# EAGLE design at32uc3_proto_v7_eagle7x (EAGLE 7.7.0)
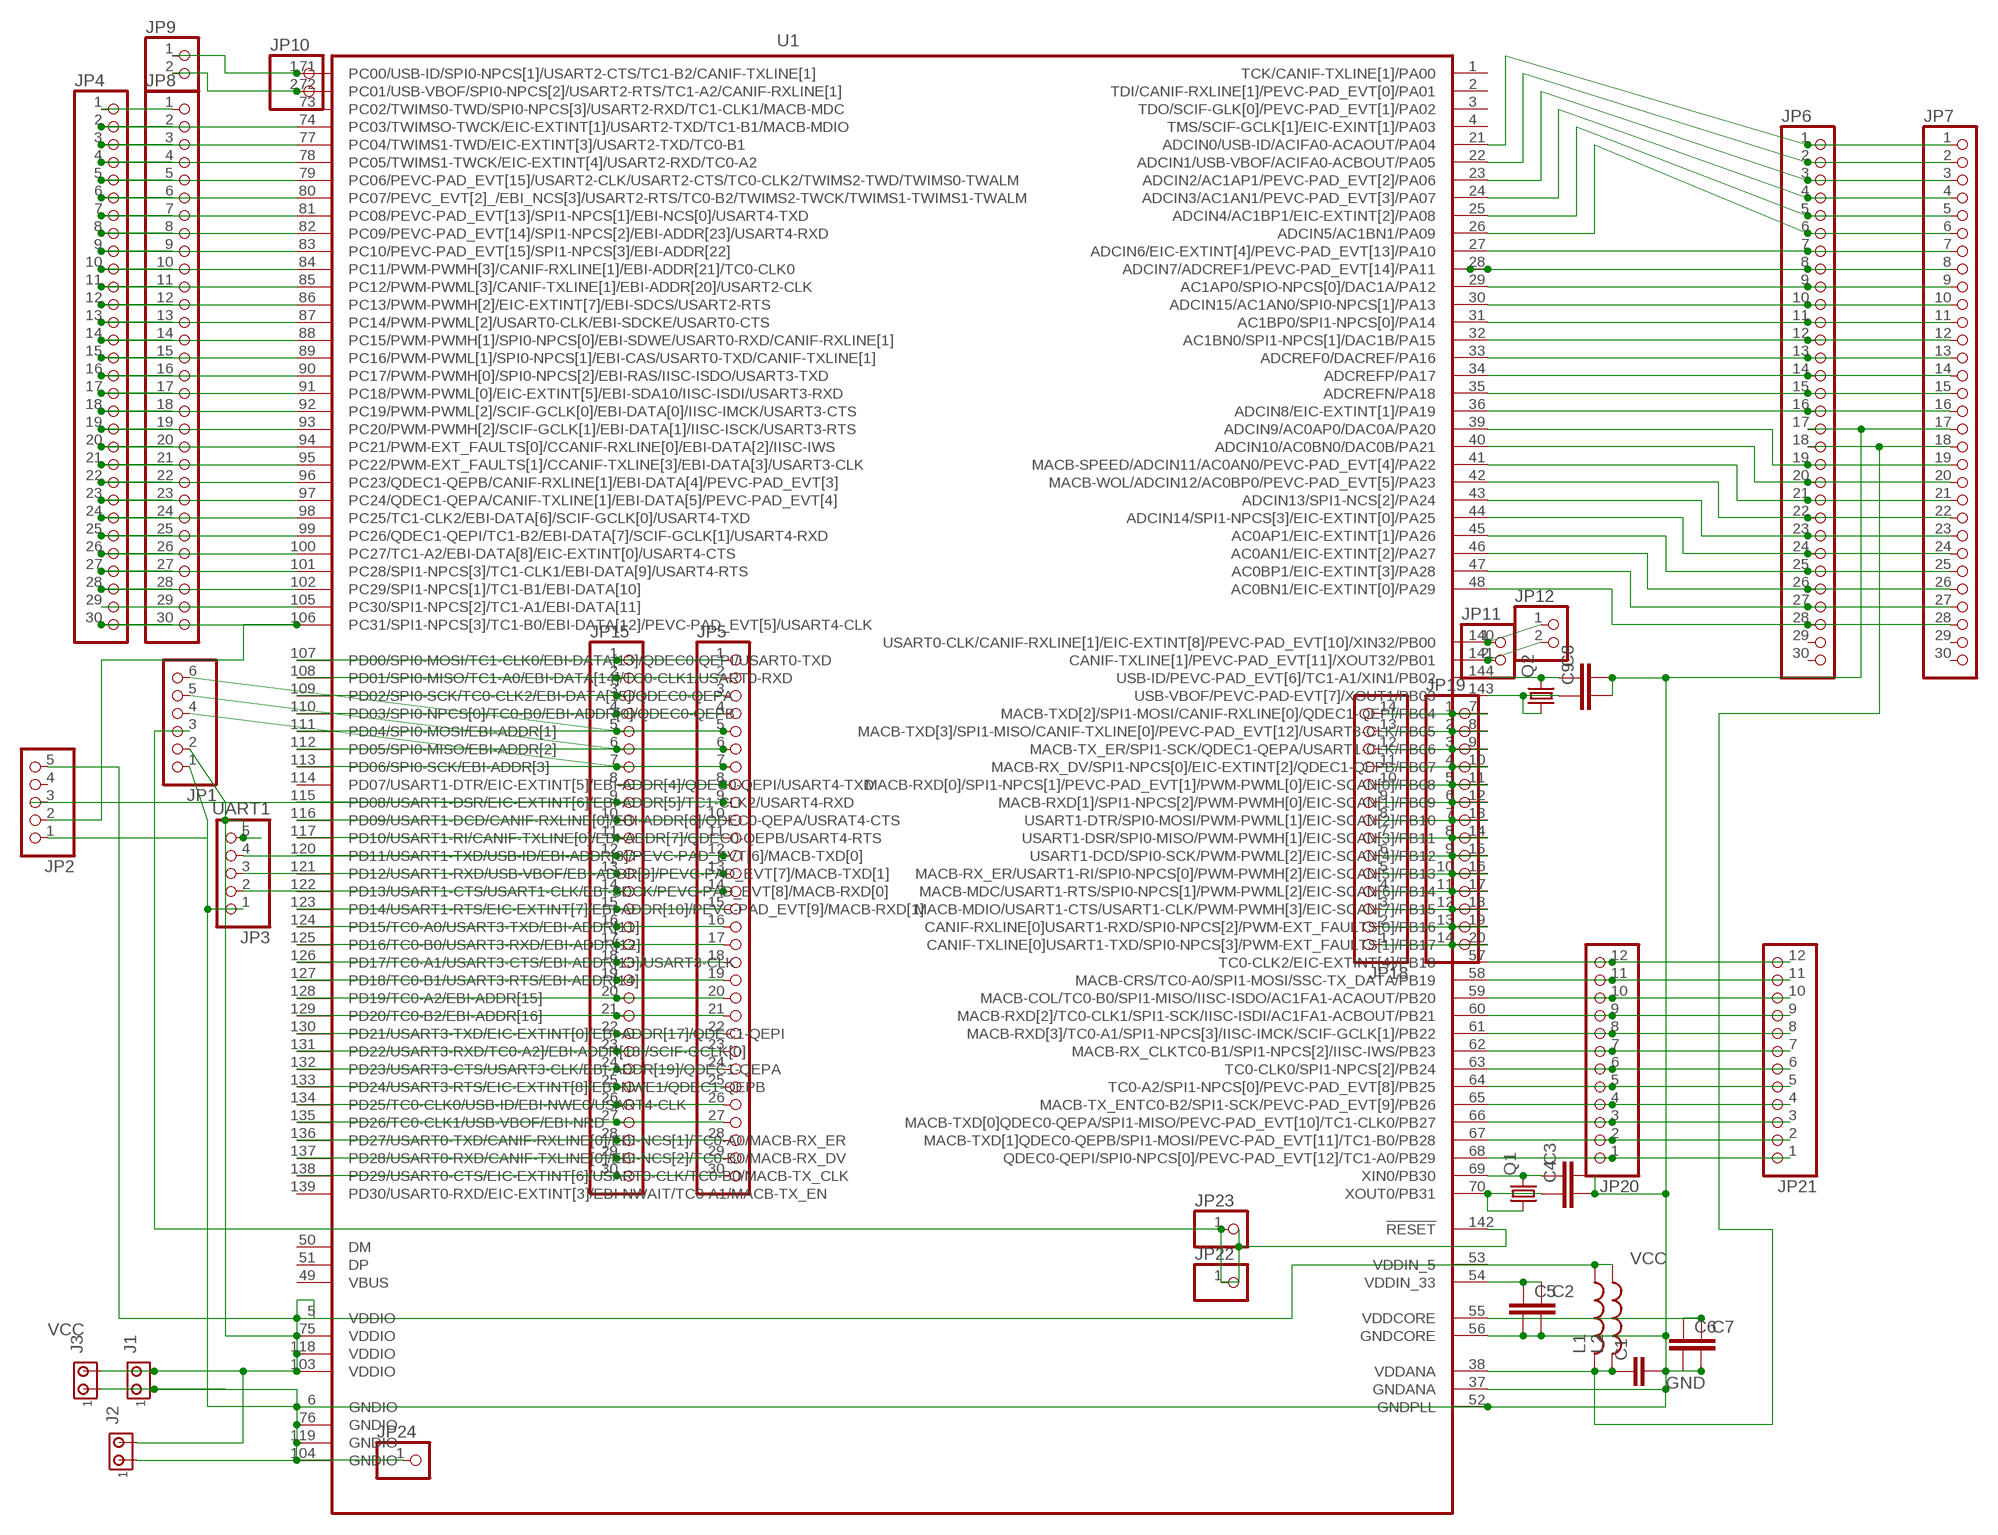
[diagram p0: schematic, sheet 1]

## Parts
C1  C-EU025-050X050  [C025-050X050]
C2  C-EUC1206K  [C1206K]
C3  C-EUC1206K  [C1206K]
C4  C-EUC1206K  [C1206K]
C5  C-EUC1206K  [C1206K]
C6  C-EUC1206K  [C1206K]
C7  C-EUC1206K  [C1206K]
C8  C-EUC1206K  [C1206K]
C9  C-EUC1206K  [C1206K]
J1  MTA02-100  [10X02MTA]
J2  MTA02-100  [10X02MTA]
J3  MTA02-100  [10X02MTA]
JP1  PINHD-1X6  [1X06]
JP2  PINHD-1X5  [1X05]
JP3  UART1  PINHD-1X5  [1X05]
JP4  PINHD-1X30  [1X30]
JP5  PINHD-1X30  [1X30]
JP6  PINHD-1X30  [1X30]
JP7  PINHD-1X30  [1X30]
JP8  PINHD-1X30  [1X30]
JP9  PINHD-1X2  [1X02]
JP10  PINHD-1X2  [1X02]
JP11  PINHD-1X2  [1X02]
JP12  PINHD-1X2  [1X02]
JP15  PINHD-1X30  [1X30]
JP18  PINHD-1X14  [1X14]
JP19  PINHD-1X14  [1X14]
JP20  PINHD-1X12  [1X12]
JP21  PINHD-1X12  [1X12]
JP22  PINHD-1X1  [1X01]
JP23  PINHD-1X1  [1X01]
JP24  PINHD-1X1  [1X01]
L1  L-US0207/10  [0207/10]
L2  L-USL4532C  [L4532M]
Q1  CRYSTALHC49S  [HC49/S]
Q2  CRYSTALHC49S  [HC49/S]
U1  AT32UC3C0128/0256/0512  [LQFP144]

## Nets
GND: C1.2 C2.2 C3.2 C4.2 C5.2 C6.2 C7.2 C8.2 C9.2 J1.1 J2.1 J3.1 JP1.1 JP2.1 JP3.1 JP6.17 JP7.17 JP24.1 U1.6(GNDIO) U1.37(GNDANA) U1.52(GNDPLL) U1.56(GNDCORE) U1.76(GNDIO) U1.104(GNDIO) U1.119(GNDIO)
N$1: C2.1 C5.1 U1.54(VDDIN_33)
N$2: C4.1 Q1.1 U1.70(XOUT0/PB31)
N$3: JP5.8 JP15.8
N$4: C3.1 Q1.2 U1.69(XIN0/PB30)
N$5: C6.1 C7.1 U1.55(VDDCORE)
N$6: C8.1 Q2.2 U1.144(USB-ID/PEVC-PAD_EVT[6]/TC1-A1/XIN1/PB02)
N$7: C9.1 Q2.1 U1.143(USB-VBOF/PEVC-PAD-EVT[7]/XOUT1/PB03)
N$8: JP1.6 JP5.5 JP15.5 U1.111(PD04/SPI0-MOSI/EBI-ADDR[1])
N$9: JP1.5 JP5.6 JP15.6 U1.112(PD05/SPI0-MISO/EBI-ADDR[2])
N$10: JP1.4 JP5.7 JP15.7 U1.113(PD06/SPI0-SCK/EBI-ADDR[3])
N$11: JP1.3 JP22.1 JP23.1 U1.142(!RESET)
N$13: JP5.9 JP15.9 U1.115(PD08/USART1-DSR/EIC-EXTINT[6]/EBI-ADDR[5]/TC1-CLK2/USART4-RXD)
N$14: JP4.1 JP8.1
N$15: JP4.2 JP8.2 U1.74(PC03/TWIMSO-TWCK/EIC-EXTINT[1]/USART2-TXD/TC1-B1/MACB-MDIO)
N$16: JP3.4 JP5.12 JP15.12 U1.120(PD11/USART1-TXD/USB-ID/EBI-ADDR[8]/PEVC-PAD_EVT[6]/MACB-TXD[0])
N$17: JP3.3 JP5.13 JP15.13 U1.121(PD12/USART1-RXD/USB-VBOF/EBI-ADDR[9]/PEVC-PAD_EVT[7]/MACB-TXD[1])
N$18: JP3.2 JP5.14 JP15.14 U1.122(PD13/USART1-CTS/USART1-CLK/EBI-SDCK/PEVC-PAD_EVT[8]/MACB-RXD[0])
N$19: JP4.3 JP8.3 U1.77(PC04/TWIMS1-TWD/EIC-EXTINT[3]/USART2-TXD/TC0-B1)
N$20: JP4.4 JP8.4 U1.78(PC05/TWIMS1-TWCK/EIC-EXTINT[4]/USART2-RXD/TC0-A2)
N$21: JP4.5 JP8.5 U1.79(PC06/PEVC-PAD_EVT[15]/USART2-CLK/USART2-CTS/TC0-CLK2/TWIMS2-TWD/TWIMS0-TWALM)
N$22: JP4.6 JP8.6 U1.80(PC07/PEVC_EVT[2]_/EBI_NCS[3]/USART2-RTS/TC0-B2/TWIMS2-TWCK/TWIMS1-TWIMS1-TWALM)
N$23: JP4.7 JP8.7 U1.81(PC08/PEVC-PAD_EVT[13]/SPI1-NPCS[1]/EBI-NCS[0]/USART4-TXD)
N$24: JP4.8 JP8.8 U1.82(PC09/PEVC-PAD_EVT[14]/SPI1-NPCS[2]/EBI-ADDR[23]/USART4-RXD)
N$25: JP4.9 JP8.9 U1.83(PC10/PEVC-PAD_EVT[15]/SPI1-NPCS[3]/EBI-ADDR[22])
N$26: JP4.10 JP8.10 U1.84(PC11/PWM-PWMH[3]/CANIF-RXLINE[1]/EBI-ADDR[21]/TC0-CLK0)
N$27: JP4.11 JP8.11 U1.85(PC12/PWM-PWML[3]/CANIF-TXLINE[1]/EBI-ADDR[20]/USART2-CLK)
N$28: JP4.12 JP8.12 U1.86(PC13/PWM-PWMH[2]/EIC-EXTINT[7]/EBI-SDCS/USART2-RTS)
N$29: JP4.13 JP8.13 U1.87(PC14/PWM-PWML[2]/USART0-CLK/EBI-SDCKE/USART0-CTS)
N$30: JP4.14 JP8.14 U1.88(PC15/PWM-PWMH[1]/SPI0-NPCS[0]/EBI-SDWE/USART0-RXD/CANIF-RXLINE[1])
N$31: JP4.15 JP8.15 U1.89(PC16/PWM-PWML[1]/SPI0-NPCS[1]/EBI-CAS/USART0-TXD/CANIF-TXLINE[1])
N$32: JP11.1 JP12.1 U1.140(USART0-CLK/CANIF-RXLINE[1]/EIC-EXTINT[8]/PEVC-PAD_EVT[10]/XIN32/PB00)
N$33: JP4.16 JP8.16 U1.90(PC17/PWM-PWMH[0]/SPI0-NPCS[2]/EBI-RAS/IISC-ISDO/USART3-TXD)
N$34: JP4.17 JP8.17 U1.91(PC18/PWM-PWML[0]/EIC-EXTINT[5]/EBI-SDA10/IISC-ISDI/USART3-RXD)
N$35: JP4.18 JP8.18 U1.92(PC19/PWM-PWML[2]/SCIF-GCLK[0]/EBI-DATA[0]/IISC-IMCK/USART3-CTS)
N$36: JP4.19 JP8.19 U1.93(PC20/PWM-PWMH[2]/SCIF-GCLK[1]/EBI-DATA[1]/IISC-ISCK/USART3-RTS)
N$37: JP4.20 JP8.20 U1.94(PC21/PWM-EXT_FAULTS[0]/CCANIF-RXLINE[0]/EBI-DATA[2]/IISC-IWS)
N$38: JP4.21 JP8.21 U1.95(PC22/PWM-EXT_FAULTS[1]/CCANIF-TXLINE[3]/EBI-DATA[3]/USART3-CLK)
N$39: JP4.22 JP8.22 U1.96(PC23/QDEC1-QEPB/CANIF-RXLINE[1]/EBI-DATA[4]/PEVC-PAD_EVT[3])
N$40: JP4.23 JP8.23 U1.97(PC24/QDEC1-QEPA/CANIF-TXLINE[1]/EBI-DATA[5]/PEVC-PAD_EVT[4])
N$41: JP4.24 JP8.24 U1.98(PC25/TC1-CLK2/EBI-DATA[6]/SCIF-GCLK[0]/USART4-TXD)
N$42: JP4.25 JP8.25 U1.99(PC26/QDEC1-QEPI/TC1-B2/EBI-DATA[7]/SCIF-GCLK[1]/USART4-RXD)
N$43: JP4.26 JP8.26 U1.100(PC27/TC1-A2/EBI-DATA[8]/EIC-EXTINT[0]/USART4-CTS)
N$44: JP4.27 JP8.27 U1.101(PC28/SPI1-NPCS[3]/TC1-CLK1/EBI-DATA[9]/USART4-RTS)
N$45: JP4.28 JP8.28 U1.102(PC29/SPI1-NPCS[1]/TC1-B1/EBI-DATA[10])
N$46: JP4.29 JP8.29 U1.105(PC30/SPI1-NPCS[2]/TC1-A1/EBI-DATA[11])
N$47: JP2.2 JP4.30 JP8.30 U1.106(PC31/SPI1-NPCS[3]/TC1-B0/EBI-DATA[12]/PEVC-PAD_EVT[5]/USART4-CLK)
N$48: JP5.1 JP15.1 U1.107(PD00/SPI0-MOSI/TC1-CLK0/EBI-DATA[13]/QDEC0-QEPI/USART0-TXD)
N$49: JP5.2 JP15.2 U1.108(PD01/SPI0-MISO/TC1-A0/EBI-DATA[14]/TC0-CLK1/USART0-RXD)
N$50: JP5.3 JP15.3 U1.109(PD02/SPI0-SCK/TC0-CLK2/EBI-DATA[15]/QDEC0-QEPA)
N$51: JP5.4 JP15.4 U1.110(PD03/SPI0-NPCS[0]/TC0-B0/EBI-ADDR[0]/QDEC0-QEPB)
N$52: JP5.10 JP15.10 U1.116(PD09/USART1-DCD/CANIF-RXLINE[0]/EBI-ADDR[6]/QDEC0-QEPA/USRAT4-CTS)
N$53: JP5.11 JP15.11 U1.117(PD10/USART1-RI/CANIF-TXLINE[0]/EBI-ADDR[7]/QDEC0-QEPB/USART4-RTS)
N$54: JP5.15 JP15.15 U1.123(PD14/USART1-RTS/EIC-EXTINT[7]/EBI-ADDR[10]/PEVC-PAD_EVT[9]/MACB-RXD[1])
N$55: JP5.16 JP15.16 U1.124(PD15/TC0-A0/USART3-TXD/EBI-ADDR[11])
N$56: JP5.17 JP15.17 U1.125(PD16/TC0-B0/USART3-RXD/EBI-ADDR[12])
N$57: JP5.18 JP15.18 U1.126(PD17/TC0-A1/USART3-CTS/EBI-ADDR[13]/USART3-CLK)
N$58: JP5.19 JP15.19 U1.127(PD18/TC0-B1/USART3-RTS/EBI-ADDR[14])
N$59: JP5.20 JP15.20 U1.128(PD19/TC0-A2/EBI-ADDR[15])
N$60: JP5.21 JP15.21 U1.129(PD20/TC0-B2/EBI-ADDR[16])
N$61: JP5.22 JP15.22 U1.130(PD21/USART3-TXD/EIC-EXTINT[0]/EBI-ADDR[17]/QDEC1-QEPI)
N$62: JP5.23 JP15.23 U1.131(PD22/USART3-RXD/TC0-A2]/EBI-ADDR[18]/SCIF-GCLK[0])
N$63: JP5.24 JP15.24 U1.132(PD23/USART3-CTS/USART3-CLK/EBI-ADDR[19]/QDEC1-QEPA)
N$64: JP5.25 JP15.25 U1.133(PD24/USART3-RTS/EIC-EXTINT[8]/EBI-NWE1/QDEC1-QEPB)
N$65: JP5.26 JP15.26 U1.134(PD25/TC0-CLK0/USB-ID/EBI-NWE0/USART4-CLK)
N$66: JP5.27 JP15.27 U1.135(PD26/TC0-CLK1/USB-VBOF/EBI-NRD)
N$67: JP5.28 JP15.28 U1.136(PD27/USART0-TXD/CANIF-RXLINE[0]/EBI-NCS[1]/TC0-A0/MACB-RX_ER)
N$68: JP5.29 JP15.29 U1.137(PD28/USART0-RXD/CANIF-TXLINE[0]/EBI-NCS[2]/TC0-B0/MACB-RX_DV)
N$69: JP5.30 JP15.30 U1.138(PD29/USART0-CTS/EIC-EXTINT[6]/USART0-CLK/TC0-B0/MACB-TX_CLK)
N$70: JP9.1 JP10.1 U1.71(PC00/USB-ID/SPI0-NPCS[1]/USART2-CTS/TC1-B2/CANIF-TXLINE[1])
N$71: JP6.1 JP7.1 U1.21(ADCIN0/USB-ID/ACIFA0-ACAOUT/PA04)
N$72: JP6.2 JP7.2 U1.22(ADCIN1/USB-VBOF/ACIFA0-ACBOUT/PA05)
N$73: JP6.3 JP7.3 U1.23(ADCIN2/AC1AP1/PEVC-PAD_EVT[2]/PA06)
N$74: JP6.4 JP7.4 U1.24(ADCIN3/AC1AN1/PEVC-PAD_EVT[3]/PA07)
N$75: JP6.5 JP7.5 U1.25(ADCIN4/AC1BP1/EIC-EXTINT[2]/PA08)
N$76: JP6.6 JP7.6 U1.26(ADCIN5/AC1BN1/PA09)
N$77: JP6.9 JP7.9 U1.29(AC1AP0/SPIO-NPCS[0]/DAC1A/PA12)
N$78: JP6.8 JP7.8 U1.28(ADCIN7/ADCREF1/PEVC-PAD_EVT[14]/PA11)
N$79: JP6.7 JP7.7 U1.27(ADCIN6/EIC-EXTINT[4]/PEVC-PAD_EVT[13]/PA10)
N$80: JP6.10 JP7.10 U1.30(ADCIN15/AC1AN0/SPI0-NPCS[1]/PA13)
N$81: JP6.11 JP7.11 U1.31(AC1BP0/SPI1-NPCS[0]/PA14)
N$82: JP6.12 JP7.12 U1.32(AC1BN0/SPI1-NPCS[1]/DAC1B/PA15)
N$83: JP6.13 JP7.13 U1.33(ADCREF0/DACREF/PA16)
N$84: JP6.14 JP7.14 U1.34(ADCREFP/PA17)
N$85: JP6.15 JP7.15 U1.35(ADCREFN/PA18)
N$86: JP6.16 JP7.16 U1.36(ADCIN8/EIC-EXTINT[1]/PA19)
N$87: JP6.19 JP7.19 U1.39(ADCIN9/AC0AP0/DAC0A/PA20)
N$88: JP6.20 JP7.20 U1.40(ADCIN10/AC0BN0/DAC0B/PA21)
N$89: JP6.21 JP7.21 U1.41(MACB-SPEED/ADCIN11/AC0AN0/PEVC-PAD_EVT[4]/PA22)
N$90: JP6.22 JP7.22 U1.42(MACB-WOL/ADCIN12/AC0BP0/PEVC-PAD_EVT[5]/PA23)
N$91: JP6.23 JP7.23 U1.43(ADCIN13/SPI1-NCS[2]/PA24)
N$92: JP6.24 JP7.24 U1.44(ADCIN14/SPI1-NPCS[3]/EIC-EXTINT[0]/PA25)
N$93: JP6.25 JP7.25 U1.45(AC0AP1/EIC-EXTINT[1]/PA26)
N$94: JP6.26 JP7.26 U1.46(AC0AN1/EIC-EXTINT[2]/PA27)
N$95: JP6.27 JP7.27 U1.47(AC0BP1/EIC-EXTINT[3]/PA28)
N$96: JP6.28 JP7.28 U1.48(AC0BN1/EIC-EXTINT[0]/PA29)
N$100: JP9.2 JP10.2 U1.72(PC01/USB-VBOF/SPI0-NPCS[2]/USART2-RTS/TC1-A2/CANIF-RXLINE[1])
N$101: JP11.2 JP12.2 U1.141(CANIF-TXLINE[1]/PEVC-PAD_EVT[11]/XOUT32/PB01)
N$106: JP18.1 JP19.14 U1.20(CANIF-TXLINE[0]USART1-TXD/SPI0-NPCS[3]/PWM-EXT_FAULTS[1]/PB17)
N$107: JP18.2 JP19.13 U1.19(CANIF-RXLINE[0]USART1-RXD/SPI0-NPCS[2]/PWM-EXT_FAULTS[0]/PB16)
N$108: JP18.3 JP19.12 U1.18(MACB-MDIO/USART1-CTS/USART1-CLK/PWM-PWMH[3]/EIC-SCAN[7]/PB15)
N$109: JP18.4 JP19.11 U1.17(MACB-MDC/USART1-RTS/SPI0-NPCS[1]/PWM-PWML[2]/EIC-SCAN[6]/PB14)
N$110: JP18.5 JP19.10 U1.16(MACB-RX_ER/USART1-RI/SPI0-NPCS[0]/PWM-PWMH[2]/EIC-SCAN[5]/PB13)
N$111: JP18.6 JP19.9 U1.15(USART1-DCD/SPI0-SCK/PWM-PWML[2]/EIC-SCAN[4]/PB12)
N$112: JP18.7 JP19.8 U1.14(USART1-DSR/SPI0-MISO/PWM-PWMH[1]/EIC-SCAN[3]/PB11)
N$113: JP18.8 JP19.7 U1.13(USART1-DTR/SPI0-MOSI/PWM-PWML[1]/EIC-SCAN[2]/PB10)
N$114: JP18.9 JP19.6 U1.12(MACB-RXD[1]/SPI1-NPCS[2]/PWM-PWMH[0]/EIC-SCAN[1]/PB09)
N$115: JP18.10 JP19.5 U1.11(MACB-RXD[0]/SPI1-NPCS[1]/PEVC-PAD_EVT[1]/PWM-PWML[0]/EIC-SCAN[0]/PB08)
N$116: JP18.11 JP19.4 U1.10(MACB-RX_DV/SPI1-NPCS[0]/EIC-EXTINT[2]/QDEC1-QEPB/PB07)
N$117: JP18.12 JP19.3 U1.9(MACB-TX_ER/SPI1-SCK/QDEC1-QEPA/USART1-CLK/PB06)
N$118: JP18.13 JP19.2 U1.8(MACB-TXD[3]/SPI1-MISO/CANIF-TXLINE[0]/PEVC-PAD_EVT[12]/USART3-CLK/PB05)
N$119: JP18.14 JP19.1 U1.7(MACB-TXD[2]/SPI1-MOSI/CANIF-RXLINE[0]/QDEC1-QEPI/PB04)
N$120: JP20.1 JP21.1 U1.68(QDEC0-QEPI/SPI0-NPCS[0]/PEVC-PAD_EVT[12]/TC1-A0/PB29)
N$121: JP20.2 JP21.2 U1.67(MACB-TXD[1]QDEC0-QEPB/SPI1-MOSI/PEVC-PAD_EVT[11]/TC1-B0/PB28)
N$122: JP20.3 JP21.3 U1.66(MACB-TXD[0]QDEC0-QEPA/SPI1-MISO/PEVC-PAD_EVT[10]/TC1-CLK0/PB27)
N$123: JP20.4 JP21.4 U1.65(MACB-TX_ENTC0-B2/SPI1-SCK/PEVC-PAD_EVT[9]/PB26)
N$124: JP20.5 JP21.5 U1.64(TC0-A2/SPI1-NPCS[0]/PEVC-PAD_EVT[8]/PB25)
N$125: JP20.6 JP21.6 U1.63(TC0-CLK0/SPI1-NPCS[2]/PB24)
N$126: JP20.7 JP21.7 U1.62(MACB-RX_CLKTC0-B1/SPI1-NPCS[2]/IISC-IWS/PB23)
N$127: JP20.8 JP21.8 U1.61(MACB-RXD[3]/TC0-A1/SPI1-NPCS[3]/IISC-IMCK/SCIF-GCLK[1]/PB22)
N$128: JP20.9 JP21.9 U1.60(MACB-RXD[2]/TC0-CLK1/SPI1-SCK/IISC-ISDI/AC1FA1-ACBOUT/PB21)
N$129: JP20.10 JP21.10 U1.59(MACB-COL/TC0-B0/SPI1-MISO/IISC-ISDO/AC1FA1-ACAOUT/PB20)
N$130: JP20.11 JP21.11 U1.58(MACB-CRS/TC0-A0/SPI1-MOSI/SSC-TX_DATA/PB19)
N$131: JP20.12 JP21.12 U1.57(TC0-CLK2/EIC-EXTINT[4]/PB18)
N$133: C1.1 JP6.18 JP7.18 L1.2 L2.2 U1.38(VDDANA)
VCC: J1.2 J2.2 J3.2 JP1.2 JP2.5 JP3.5 L1.1 L2.1 U1.5(VDDIO) U1.53(VDDIN_5) U1.75(VDDIO) U1.103(VDDIO) U1.118(VDDIO)
Unconnected: JP2.3 JP2.4 JP6.29 JP6.30 JP7.29 JP7.30 U1.1(TCK/CANIF-TXLINE[1]/PA00) U1.2(TDI/CANIF-RXLINE[1]/PEVC-PAD_EVT[0]/PA01) U1.3(TDO/SCIF-GLK[0]/PEVC-PAD_EVT[1]/PA02) U1.4(TMS/SCIF-GCLK[1]/EIC-EXINT[1]/PA03) U1.49(VBUS) U1.50(DM) U1.51(DP) U1.73(PC02/TWIMS0-TWD/SPI0-NPCS[3]/USART2-RXD/TC1-CLK1/MACB-MDC) U1.114(PD07/USART1-DTR/EIC-EXTINT[5]/EBI-ADDR[4]/QDEC0-QEPI/USART4-TXD) U1.139(PD30/USART0-RXD/EIC-EXTINT[3]/EBI-NWAIT/TC0-A1/MACB-TX_EN)

## Library data of the parts
C1-C9 = rcl:C-EU: CAPACITOR, European symbol
J1-J3 = con-amp:MTA02-100: AMP connector
JP1 = pinhead:PINHD-1X6: PIN HEADER
JP2 JP3 = pinhead:PINHD-1X5: PIN HEADER
JP4-JP8 JP15 = pinhead:PINHD-1X30: PIN HEADER
JP9-JP12 = pinhead:PINHD-1X2: PIN HEADER
JP18 JP19 = pinhead:PINHD-1X14: PIN HEADER
JP20 JP21 = pinhead:PINHD-1X12: PIN HEADER
JP22-JP24 = pinhead:PINHD-1X1: PIN HEADER
L1 L2 = rcl:L-US: INDUCTOR, American symbol
Q1 Q2 = crystal:CRYSTAL: CRYSTAL
U1 = atmel-avr32-michel-rev1 - Copy:AT32UC3C0128/0256/0512: AT32UC3C0128/0256/0512

## Board
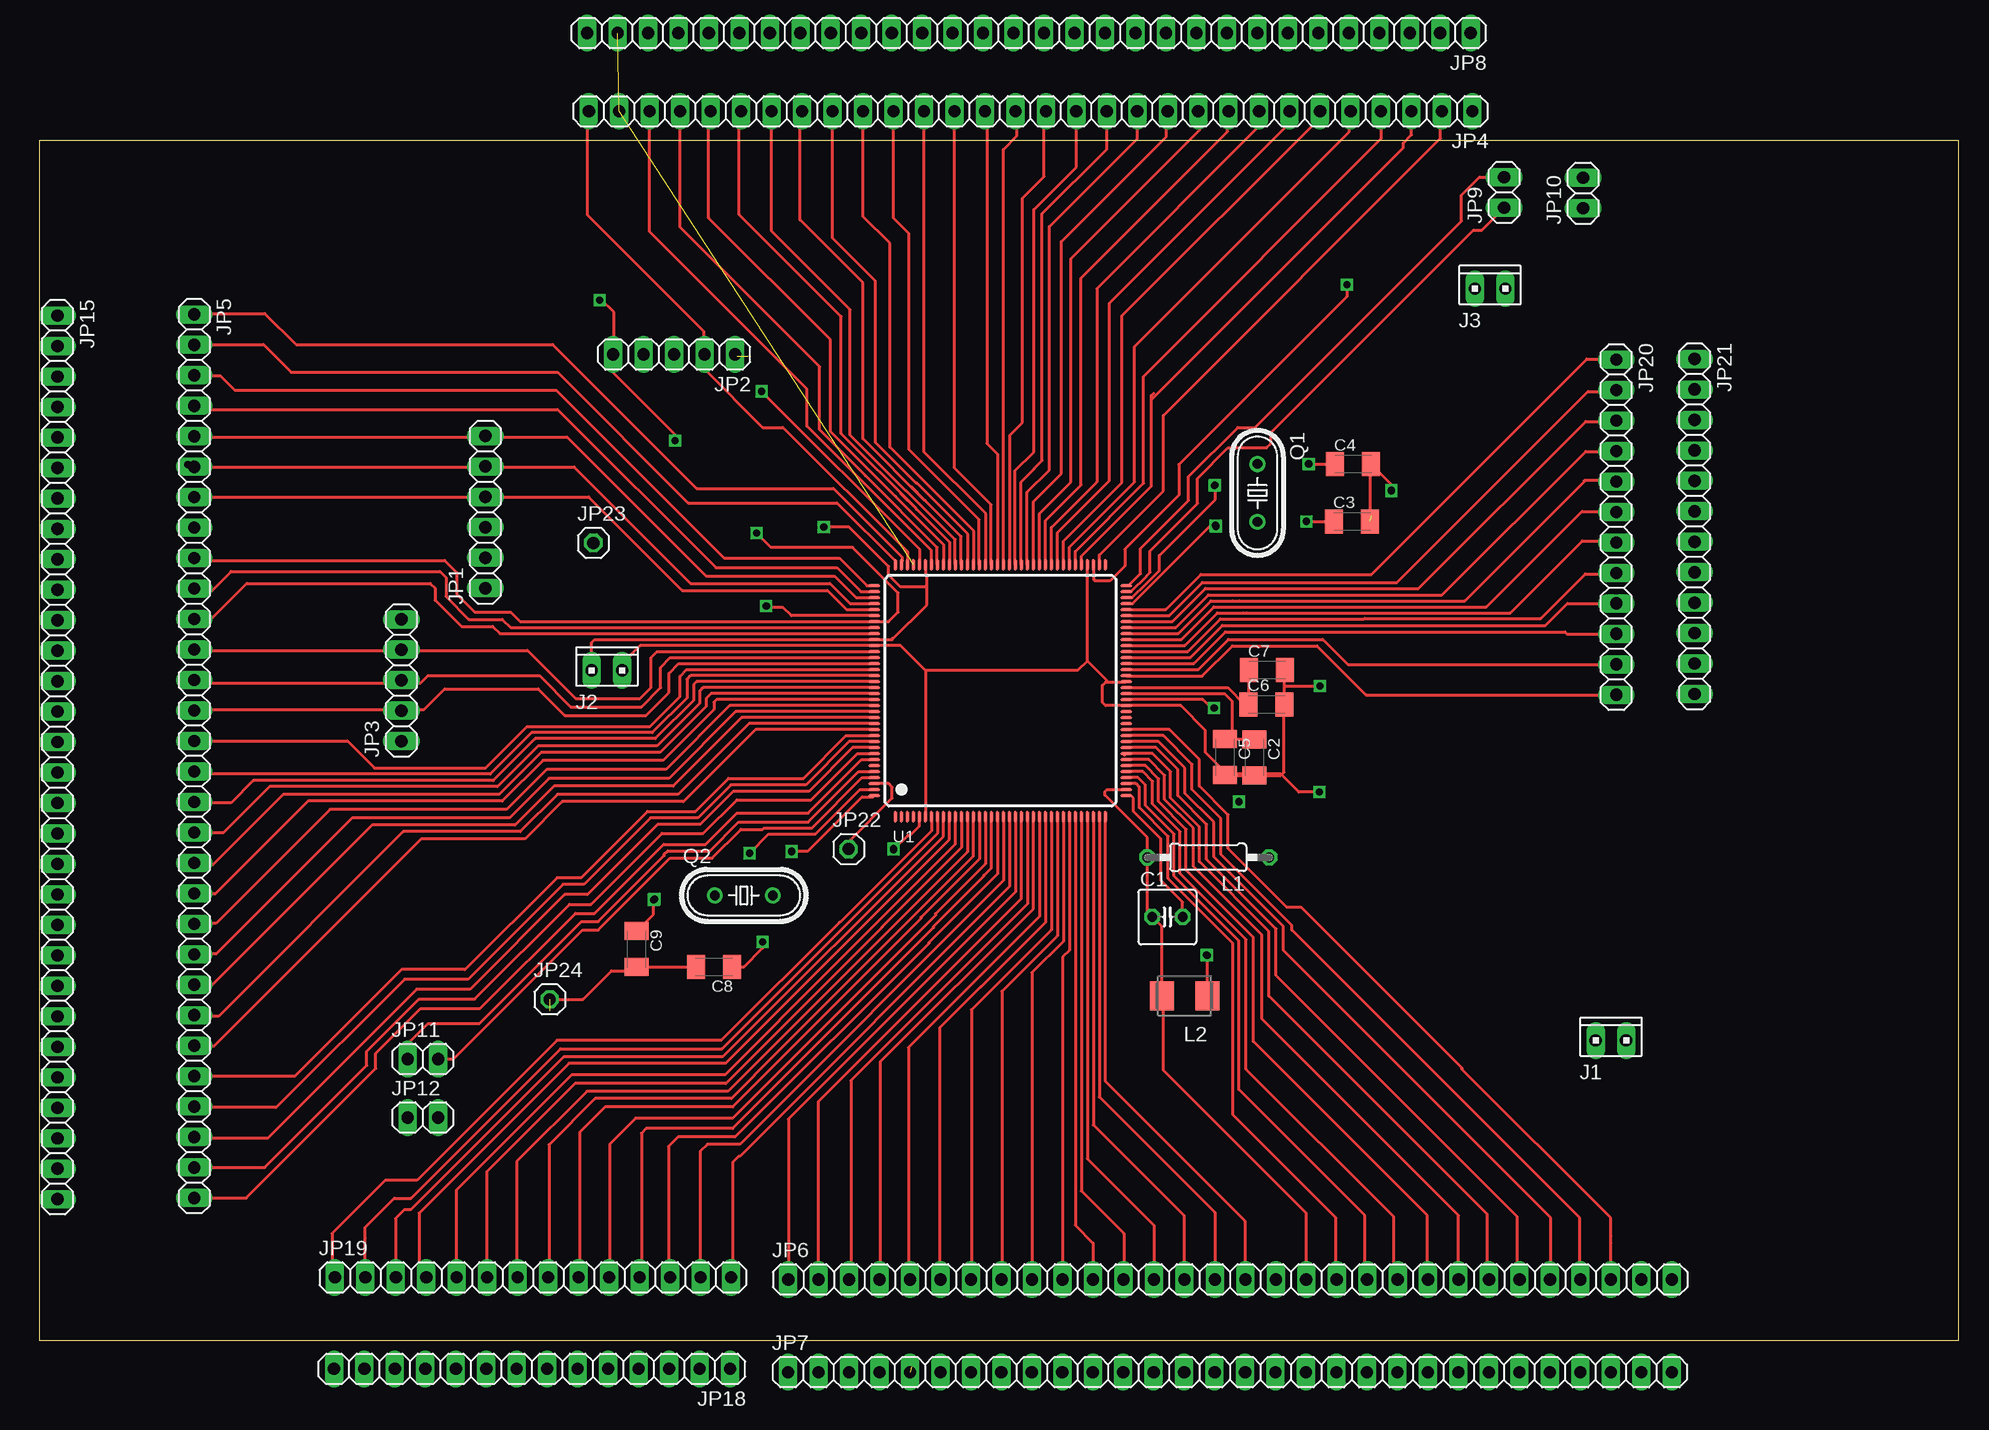
[diagram p1: board, top side]
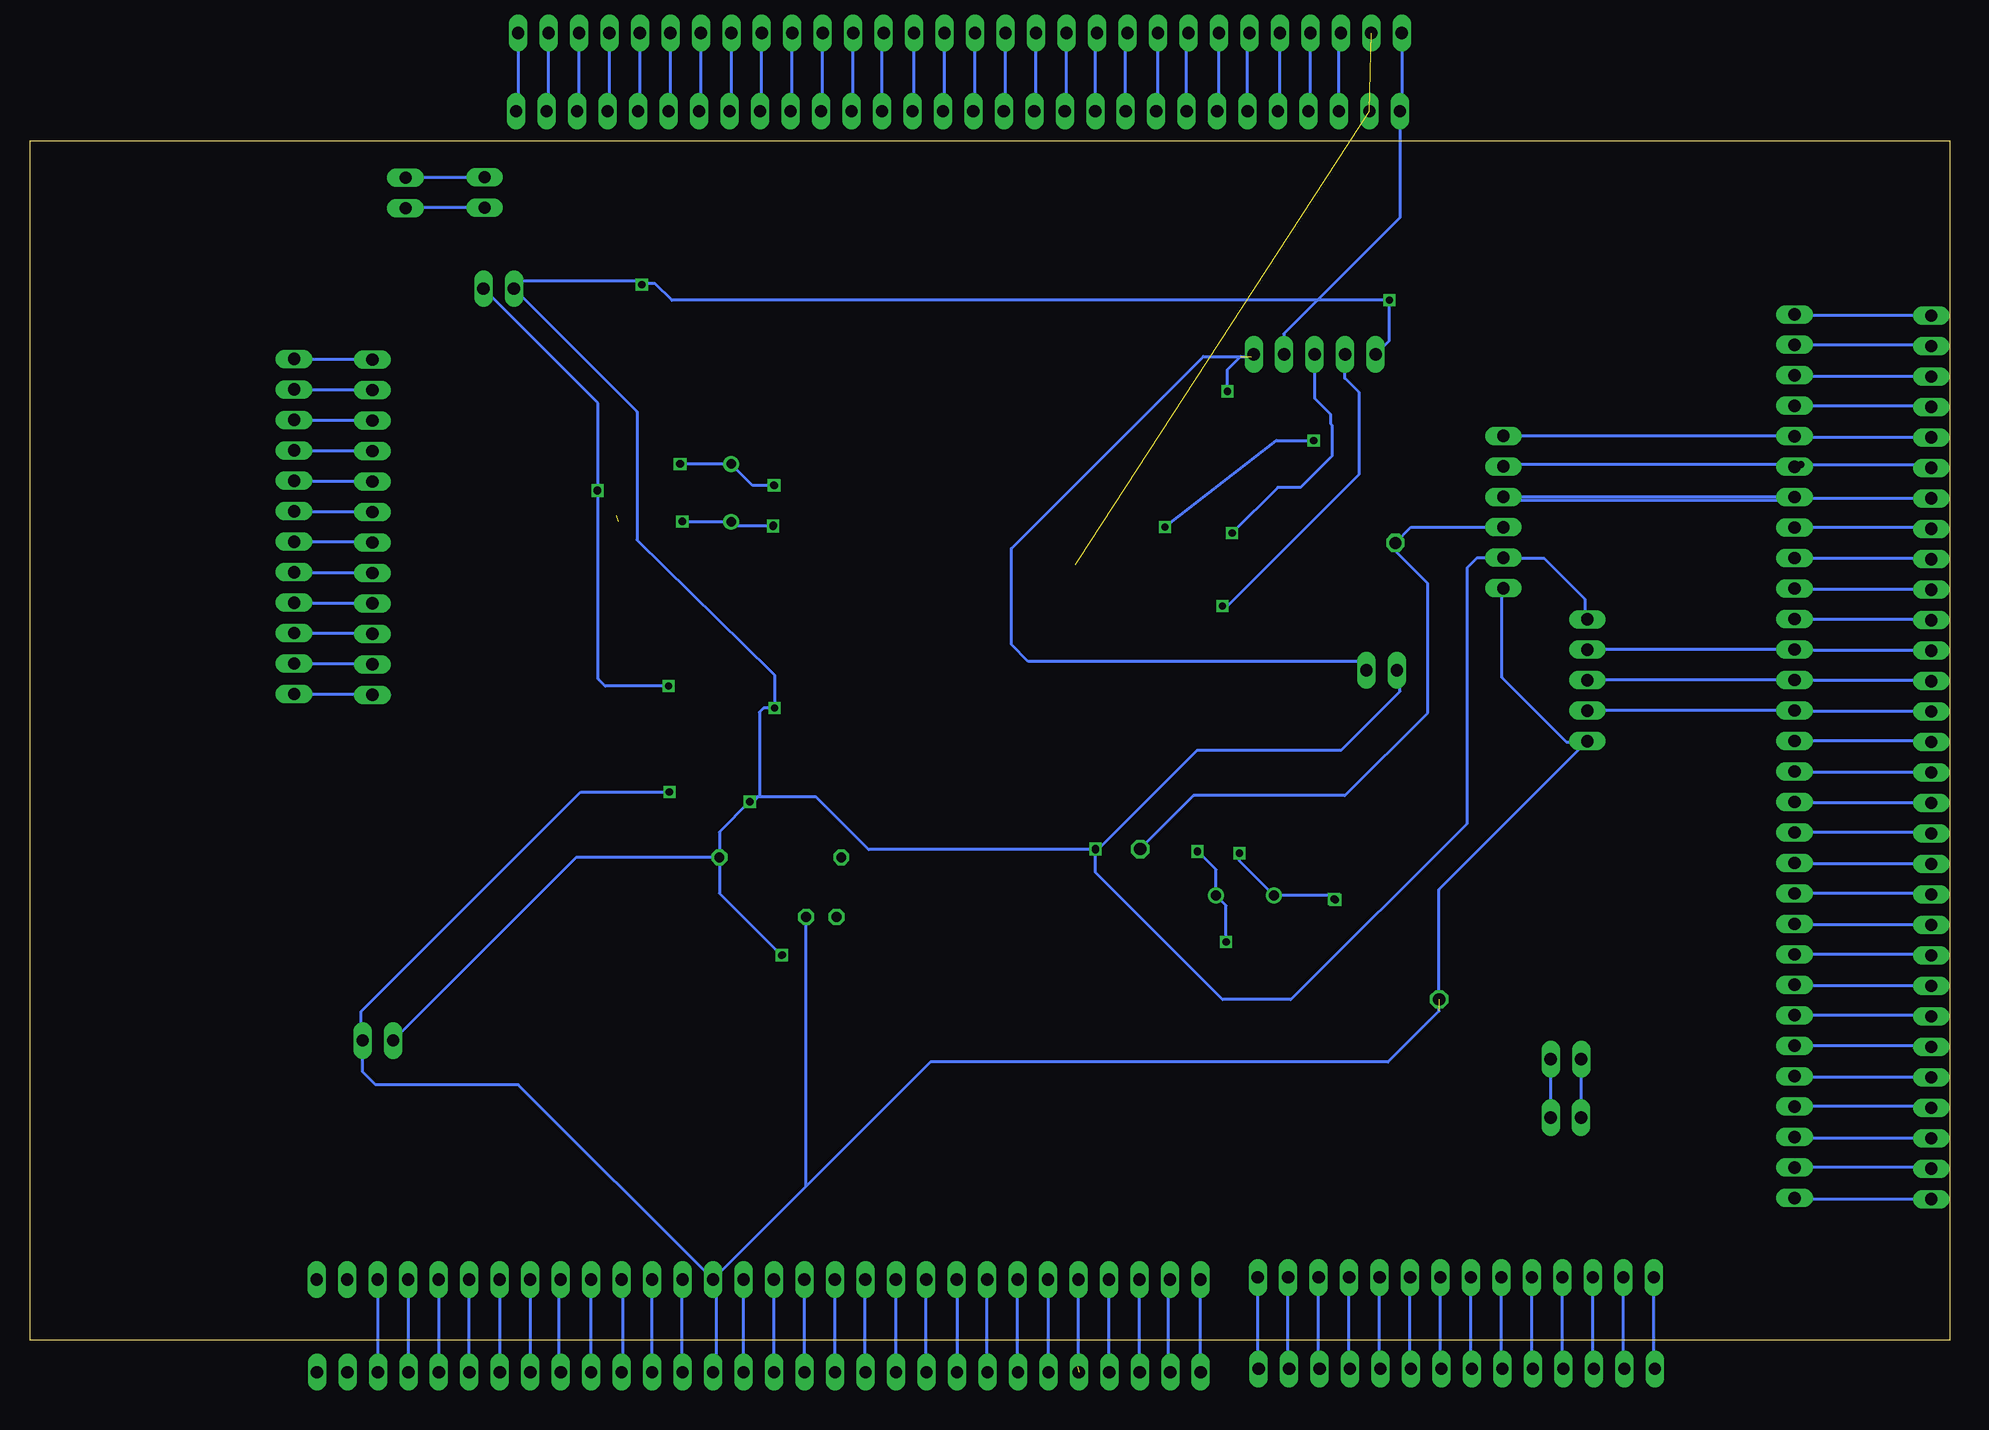
[diagram p2: board, bottom side, seen from below]

Size 160 x 100 mm. Coordinates in mm from the lower left corner, seen from the top.
Outline: 0,0 160,0 160,100 0,100 0,0
Copper layers (1*16): Top 0.035mm / dielectric 1.5mm / Bottom 0.035mm
Design rules "default": minimum track width 10mil, minimum drill 24mil, track to track 8mil, track to pad 8mil, pad to pad 8mil, via to via 8mil, smd to smd 8mil, copper to edge 40mil, drill to drill 8mil, minimum pad ring 10mil, minimum via ring 8mil, stop-mask expansion 4mil, vias tented up to drill 0mil, thermal gap 10mil

### Footprints (pad centres in the part's own frame; a part is rotated, then mirrored left to right if it is on the bottom)
C025-050X050 = drill 0.813 octagon: 1 -1.27,0; 2 1.27,0
C1206K = smd 1.5 x 2: 1 -1.5,0; 2 1.5,0
10X02MTA = drill 1.016 long: 1 1.27,0; 2 -1.27,0
1X06 = drill 1.016 long: 1 -6.35,0; 2 -3.81,0; 3 -1.27,0; 4 1.27,0; 5 3.81,0; 6 6.35,0
1X05 = drill 1.016 long: 1 -5.08,0; 2 -2.54,0; 3 0,0; 4 2.54,0; 5 5.08,0
1X30 = drill 1.016 long: 1 -36.83,0; 2 -34.29,0; 3 -31.75,0; 4 -29.21,0; 5 -26.67,0; 6 -24.13,0; 7 -21.59,0; 8 -19.05,0; 9 -16.51,0; 10 -13.97,0; 11 -11.43,0; 12 -8.89,0; 13 -6.35,0; 14 -3.81,0; 15 -1.27,0; 16 1.27,0; 17 3.81,0; 18 6.35,0; 19 8.89,0; 20 11.43,0; 21 13.97,0; 22 16.51,0; 23 19.05,0; 24 21.59,0; 25 24.13,0; 26 26.67,0; 27 29.21,0; 28 31.75,0; 29 34.29,0; 30 36.83,0
1X02 = drill 1.016 long: 1 -1.27,0; 2 1.27,0
1X14 = drill 1.016 long: 1 -16.51,0; 2 -13.97,0; 3 -11.43,0; 4 -8.89,0; 5 -6.35,0; 6 -3.81,0; 7 -1.27,0; 8 1.27,0; 9 3.81,0; 10 6.35,0; 11 8.89,0; 12 11.43,0; 13 13.97,0; 14 16.51,0
1X12 = drill 1.016 long: 1 -13.97,0; 2 -11.43,0; 3 -8.89,0; 4 -6.35,0; 5 -3.81,0; 6 -1.27,0; 7 1.27,0; 8 3.81,0; 9 6.35,0; 10 8.89,0; 11 11.43,0; 12 13.97,0
1X01 = drill 1.016 octagon: 1 0,0
0207/10 = drill 0.813 octagon: 1 -5.08,0; 2 5.08,0
L4532M = smd 2 x 2.4: 1 -1.9,0; 2 1.9,0
HC49/S = drill 0.813: 1 -2.413,0; 2 2.413,0
LQFP144 = smd 0.25 x 1: 1 -8.75,-10.5; 2 -8.25,-10.5; 3 -7.75,-10.5; 4 -7.25,-10.5; 5 -6.75,-10.5; 6 -6.25,-10.5; 7 -5.75,-10.5; 8 -5.25,-10.5; 9 -4.75,-10.5; 10 -4.25,-10.5; 11 -3.75,-10.5; 12 -3.25,-10.5; 13 -2.75,-10.5; 14 -2.25,-10.5; 15 -1.75,-10.5; 16 -1.25,-10.5; 17 -0.75,-10.5; 18 -0.25,-10.5; 19 0.25,-10.5; 20 0.75,-10.5; 21 1.25,-10.5; 22 1.75,-10.5; 23 2.25,-10.5; 24 2.75,-10.5; 25 3.25,-10.5; 26 3.75,-10.5; 27 4.25,-10.5; 28 4.75,-10.5; 29 5.25,-10.5; 30 5.75,-10.5; 31 6.25,-10.5; 32 6.75,-10.5; 33 7.25,-10.5; 34 7.75,-10.5; 35 8.25,-10.5; 36 8.75,-10.5; 73 8.75,10.5; 74 8.25,10.5; 75 7.75,10.5; 76 7.25,10.5; 77 6.75,10.5; 78 6.25,10.5; 79 5.75,10.5; 80 5.25,10.5; 81 4.75,10.5; 82 4.25,10.5; 83 3.75,10.5; 84 3.25,10.5; 85 2.75,10.5; 86 2.25,10.5; 87 1.75,10.5; 88 1.25,10.5; 89 0.75,10.5; 90 0.25,10.5; 91 -0.25,10.5; 92 -0.75,10.5; 93 -1.25,10.5; 94 -1.75,10.5; 95 -2.25,10.5; 96 -2.75,10.5; 97 -3.25,10.5; 98 -3.75,10.5; 99 -4.25,10.5; 100 -4.75,10.5; 101 -5.25,10.5; 102 -5.75,10.5; 103 -6.25,10.5; 104 -6.75,10.5; 105 -7.25,10.5; 106 -7.75,10.5; 107 -8.25,10.5; 108 -8.75,10.5 | smd 1 x 0.25: 37 10.5,-8.75; 38 10.5,-8.25; 39 10.5,-7.75; 40 10.5,-7.25; 41 10.5,-6.75; 42 10.5,-6.25; 43 10.5,-5.75; 44 10.5,-5.25; 45 10.5,-4.75; 46 10.5,-4.25; 47 10.5,-3.75; 48 10.5,-3.25; 49 10.5,-2.75; 50 10.5,-2.25; 51 10.5,-1.75; 52 10.5,-1.25; 53 10.5,-0.75; 54 10.5,-0.25; 55 10.5,0.25; 56 10.5,0.75; 57 10.5,1.25; 58 10.5,1.75; 59 10.5,2.25; 60 10.5,2.75; 61 10.5,3.25; 62 10.5,3.75; 63 10.5,4.25; 64 10.5,4.75; 65 10.5,5.25; 66 10.5,5.75; 67 10.5,6.25; 68 10.5,6.75; 69 10.5,7.25; 70 10.5,7.75; 71 10.5,8.25; 72 10.5,8.75; 109 -10.5,8.75; 110 -10.5,8.25; 111 -10.5,7.75; 112 -10.5,7.25; 113 -10.5,6.75; 114 -10.5,6.25; 115 -10.5,5.75; 116 -10.5,5.25; 117 -10.5,4.75; 118 -10.5,4.25; 119 -10.5,3.75; 120 -10.5,3.25; 121 -10.5,2.75; 122 -10.5,2.25; 123 -10.5,1.75; 124 -10.5,1.25; 125 -10.5,0.75; 126 -10.5,0.25; 127 -10.5,-0.25; 128 -10.5,-0.75; 129 -10.5,-1.25; 130 -10.5,-1.75; 131 -10.5,-2.25; 132 -10.5,-2.75; 133 -10.5,-3.25; 134 -10.5,-3.75; 135 -10.5,-4.25; 136 -10.5,-4.75; 137 -10.5,-5.25; 138 -10.5,-5.75; 139 -10.5,-6.25; 140 -10.5,-6.75; 141 -10.5,-7.25; 142 -10.5,-7.75; 143 -10.5,-8.25; 144 -10.5,-8.75

### Placement (x,y rotation side)
C1  94.04,35.29 0 top
C2  101.29,48.59 270 top
C3  109.44,68.26 0 top
C4  109.52,73.04 0 top
C5  98.83,48.62 270 top
C6  102.3,53.01 0 top
C7  102.35,55.85 0 top
C8  56.25,31.14 180 top
C9  49.8,32.62 270 top
J1  131.01,24.99 0 top
J2  47.32,55.85 0 top
J3  120.94,87.66 0 top
JP1  37.18,69.04 90 top
JP2  52.92,82.18 180 top
JP3  30.18,55.02 90 top
JP4  82.64,102.45 180 top
JP5  12.92,48.69 270 top
JP6  99.26,5.07 0 top
JP7  99.25,-2.66 0 top
JP8  82.49,108.97 180 top  (outside the outline)
JP9  122.11,95.7 90 top
JP10  128.7,95.63 90 top
JP11  31.97,23.44 0 top
JP12  31.98,18.56 0 top
JP15  1.52,48.59 270 top
JP18  41.08,-2.39 180 top
JP19  41.16,5.24 0 top
JP20  131.46,67.78 270 top
JP21  137.99,67.84 270 top
JP22  67.46,40.95 0 top
JP23  46.19,66.47 0 top
JP24  42.55,28.42 0 top
L1  97.45,40.25 180 top
L2  95.47,28.71 180 top
Q1  101.55,70.64 270 top
Q2  58.73,37.08 0 top
U1  80.11,54.15 0 top

### Tracks (layer width: path | path; a pad name or v marks a point on that pad's centre or on a via)
GND  (via drill 0.6)  (3 unrouted)
  Top 0.254: C3.2 110.94,72.96 C4.2 112.7,71.35 v112.7,70.81 | U1.56 88.93,54.89 | 88.93,54.89 88.63,54.59 88.63,53.17 88.89,52.9 U1.52 95.15,52.9 97.2,50.85 97.2,49 98.83,47.37 | C2.2 100.55,47.12 | C7.2 103.8,55.8 103.8,54.53 | 103.8,54.53 C6.2 103.76,52.97 103.76,47.35 103.5,47.09 C2.2 | C1.2 95.31,36.53 93.5,38.34 93.5,41.8 91.2,44.1 91.2,45.2 91,45.4 U1.37 | 111.08,68.76 111.08,69.18 | 103.8,54.53 v106.76,54.53 | 98.83,47.37 C5.2 98.86,47.09 C2.2 | 98.83,47.37 99,47.2 103.5,47.2 105,45.7 v106.7,45.7 | C8.2 49.83,31.14 C9.2 49.48,30.8 47.7,30.8 45.32,28.42 JP24.1 | 73.86,55.84 U1.6 | 73.86,55.84 71.8,57.9 U1.119 50.1,57.9 48.59,56.39 J2.1 | 88.93,54.89 88.93,54.93 89,55 87.36,56.64 | 87.36,56.64 U1.76 | 73.86,55.84 86.56,55.84 87.36,56.64 | U1.104 73.4,64.69 73.4,65.9 v60.2,79.1
  Bottom 0.254: 106.7,54.53 v106.76,54.53 112.04,54.53 112.64,55.13 112.64,70.75 v112.7,70.81 112.7,71.35 112.65,71.41 112.65,78.1 J3.1 | 95.31,12.83 JP6.17 | 95.31,12.83 C1.2 | JP6.17 119.31,21.3 131.2,21.3 132.28,22.38 J1.1 132.4,25.11 132.4,27.4 114.1,45.7 v106.7,45.7 | JP1.1 37.3,62.57 37.3,55.25 31.9,49.85 30.27,49.85 JP3.1 42.55,37.58 42.55,27.45 46.8,23.2 84.94,23.2 95.31,12.83 | JP6.17 103.07,4.27 102.8,4 102.8,-2.4 JP7.17 | v60.2,79.1 60.2,80.9 59.1,82 | JP2.1 58.18,82 62.2,82 78.2,66 78.2,58 76.8,56.6 49.34,56.6 J2.1
N$1
  Top 0.254: C2.1 101.26,50.12 C5.1 99.4,50.69 99.4,53.3 98.8,53.9 U1.54
N$2  (via drill 0.6)
  Top 0.254: U1.70 91.11,61.9 92.3,63.09 93.37,64.17 93.37,65.42 98.04,70.09 98.04,71.18 v97.96,71.26 | v105.83,73.05 108,73.05 C4.1
  Bottom 0.254: v97.96,71.26 99.76,71.26 Q1.1 v105.83,73.05
N$3
  Bottom 0.254: JP5.8 1.61,67.74 JP15.8
N$4  (via drill 0.6)
  Top 0.254: U1.69 91.14,61.4 97.59,67.86 v98.07,67.86 | v105.62,68.27 107.93,68.27 C3.1
  Bottom 0.254: v98.07,67.86 101.18,67.86 Q1.2 105.58,68.22 v105.62,68.27
N$5
  Top 0.254: U1.55 90.62,54.41 99.07,54.41 100.47,53.01 C6.1 100.85,53.06 C7.1
N$6  (via drill 0.6)
  Top 0.254: v62.7,40.8 64.1,40.8 68.6,45.3 69.51,45.3 U1.144 | C8.1 58.74,31.14 60.3,32.7 v60.3,33.2
  Bottom 0.254: v62.7,40.8 61.15,39.24 Q2.2 60.3,36.24 v60.3,33.2
N$7  (via drill 0.6)
  Top 0.254: U1.143 68.4,45.9 64.7,42.2 60.8,42.2 v59.2,40.6 | v51.2,36.7 51.2,35.52 C9.1
  Bottom 0.254: v59.2,40.6 59.2,39.96 Q2.1 51.58,37.08 v51.2,36.7
N$8
  Top 0.254: U1.111 68.1,61.9 66.3,63.7 55.6,63.7 44,75.3 12.98,75.3 JP5.5 | JP1.6 37.27,75.3
  Bottom 0.254: JP1.6 37.15,75.36 JP5.5 12.83,75.26 JP15.5
N$9  (via drill 0.6)
  Top 0.254: U1.112 67.6,61.4 65.9,63.1 54.3,63.1 44.6,72.8 12.6,72.8 v12.4,73 12.74,73 JP5.6
  Bottom 0.254: JP1.5 37.03,73 v12.4,73 1.79,73 JP15.6
N$10
  Top 0.254: U1.113 67.3,60.9 65.7,62.5 53.6,62.5 45.8,70.3 12.95,70.3 JP5.7
  Bottom 0.254: JP5.7 37.15,70.28 JP1.4 | JP5.7 13.12,70.28 13.4,70 36.9,70 37.2,70.3 | JP15.7 12.83,70.18 JP5.7
N$11
  Top 0.254: U1.142 70.8,46.4 71.1,46.1 71.1,45.2 67.5,41.6 67.5,40.98 JP22.1
  Bottom 0.254: JP1.3 44.88,67.77 JP23.1 46.19,65.79 43.5,63.1 43.5,52.3 50.4,45.4 63.01,45.4 JP22.1
N$12  (via drill 0.6)
  other vias: 98.05,67.93
N$13
  Top 0.254: U1.115 40.1,59.9 39.3,60.7 36.3,60.7 34.8,62.2 34.8,64 33.8,65 13.12,65 JP5.9
  Bottom 0.254: JP5.9 1.61,65.2 JP15.9
N$14
  Bottom 0.254: JP8.1 119.32,102.6 JP4.1
N$15
  Top 0.254: U1.74 88.36,65.46 93.7,70.8 93.7,77.1 116.8,100.2 116.8,102.33 JP4.2
  Bottom 0.254: JP8.2 116.78,102.6 JP4.2
N$16
  Top 0.254: 13.1,57.4 JP5.12 13,57.5 40.7,57.5 44.7,53.5 50.1,53.5 51,54.4 51,56.9 51.5,57.4 U1.120
  Bottom 0.254: JP3.4 30.17,57.58 JP5.12 12.83,57.48 JP15.12
N$17
  Top 0.254: U1.121 52.6,56.9 51.8,56.1 51.8,54.4 50.2,52.8 44.3,52.8 41.7,55.4 32.4,55.4 31.8,54.8 13.16,54.8 JP5.13
  Bottom 0.254: JP3.3 30.17,55.04 JP5.13 1.61,55.04 JP15.13
N$18
  Top 0.254: JP5.14 13.03,52.6 32.1,52.6 33.8,54.3 41.6,54.3 43.8,52.1 50.6,52.1 52.5,54 52.5,55.6 53.3,56.4 U1.122
  Bottom 0.254: JP3.2 30.16,52.5 13.7,52.5 JP5.14 12.83,52.4 JP15.14
N$19
  Top 0.254: U1.77 86.86,65.36 92.7,71.2 92.7,78.4 | 92.7,78.4 92.7,78.75 92.9,78.95 | JP4.3 114.39,100.49 113.7,99.8 113.7,99.4 92.7,78.4
  Bottom 0.254: JP8.3 114.24,102.6 JP4.3
N$20
  Top 0.254: U1.78 86.36,65.76 92.05,71.45 92.05,80.35 111.85,100.15 JP4.4
  Bottom 0.254: JP8.4 111.7,102.6 JP4.4
N$21
  Top 0.254: U1.79 85.86,66.11 91.3,71.55 91.3,82.85 109.2,100.75 109.2,102.35 JP4.5
  Bottom 0.254: JP8.5 109.16,102.6 JP4.5
N$22
  Top 0.254: U1.80 85.36,66.61 90.25,71.5 90.25,85.4 106.7,101.85 106.7,102.39 JP4.6
  Bottom 0.254: JP8.6 106.62,102.6 JP4.6
N$23
  Top 0.254: U1.81 84.86,67.31 89.2,71.65 89.2,86.45 104.1,101.35 104.1,102.33 JP4.7
  Bottom 0.254: JP8.7 104.08,102.6 JP4.7
N$24
  Top 0.254: U1.82 84.36,67.76 88.15,71.55 88.15,87.65 101.69,101.19 JP4.8
  Bottom 0.254: JP8.8 101.54,102.6 JP4.8
N$25
  Top 0.254: U1.83 83.86,68.31 86.85,71.3 86.85,88.55 99.05,100.75 99.05,102.36 JP4.9
  Bottom 0.254: JP8.9 99,102.6 JP4.9
N$26
  Top 0.254: U1.84 83.36,68.91 86,71.55 86,90.15 96.75,100.9 96.75,102.31 JP4.10
  Bottom 0.254: JP8.10 96.46,102.6 JP4.10
N$27
  Top 0.254: U1.85 82.86,69.91 85.2,72.25 85.2,91.6 93.95,100.35 93.95,102.34 JP4.11
  Bottom 0.254: JP8.11 93.92,102.6 JP4.11
N$28
  Top 0.254: U1.86 82.35,64.67 82.35,70.7 84.2,72.55 84.2,92.85 91.53,100.18 JP4.12
  Bottom 0.254: JP8.12 91.38,102.6 JP4.12
N$29
  Top 0.254: U1.87 81.85,64.67 81.85,71.55 82.95,72.65 82.95,72.7 83.6,73.35 83.6,93.9 88.99,99.29 JP4.13
  Bottom 0.254: JP4.13 88.99,108.83 JP8.13
N$30
  Top 0.254: U1.88 81.35,64.67 81.35,72.5 82.9,74.05 82.9,94.25 86.45,97.8 JP4.14
  Bottom 0.254: JP8.14 86.3,102.6 JP4.14
N$31
  Top 0.254: U1.89 80.9,64.69 80.9,75.45 81.95,76.5 81.95,95.2 83.76,97.01 83.76,103 83.91,102.85 JP4.15
  Bottom 0.254: JP8.15 83.76,102.6 JP4.15
N$32
  Top 0.254: U1.140 68.3,47.4 64.1,43.2 58.3,43.2 55.9,40.8 52.4,40.8 52.1,40.5 52.1,40.4 46.6,34.9 45.2,34.9 36.7,26.4 32.4,26.4 30.8,24.8 30.8,23.54 JP11.1
  Bottom 0.254: JP11.1 30.7,18.3 30.5,18.1 30.5,18.36 JP12.1
N$33
  Top 0.254: U1.90 80.36,99.26 81.5,100.4 81.5,102.32 JP4.16
  Bottom 0.254: JP8.16 81.22,102.6 JP4.16
N$34
  Top 0.254: JP4.17 79,102.28 79,74.75 79.86,73.89 U1.91
  Bottom 0.254: JP8.17 78.68,102.6 JP4.17
N$35
  Top 0.254: U1.92 79.35,64.67 79.35,69.65 76.29,72.71 JP4.18
  Bottom 0.254: JP8.18 76.14,102.6 JP4.18
N$36
  Top 0.254: U1.93 78.9,64.69 78.9,68.9 73.75,74.05 JP4.19
  Bottom 0.254: JP8.19 73.6,102.6 JP4.19
N$37
  Top 0.254: U1.94 78.35,64.67 78.35,68.4 72.5,74.25 72.5,92.25 71.21,93.54 JP4.20
  Bottom 0.254: JP4.20 71.21,108.83 JP8.20
N$38
  Top 0.254: U1.95 77.9,64.69 77.9,67.45 70.9,74.45 70.9,91.45 68.67,93.68 JP4.21
  Bottom 0.254: JP4.21 68.67,108.83 JP8.21
N$39
  Top 0.254: U1.96 77.4,64.69 77.4,67.2 73.15,71.45 73.1,71.45 69.7,74.85 69.7,88.3 66.13,91.87 JP4.22
  Bottom 0.254: JP8.22 65.98,102.6 JP4.22
N$40
  Top 0.254: U1.97 76.85,64.67 76.85,67 73.85,70 | 73.85,70 72.7,71.15 | JP4.23 63.4,102.27 63.4,93.4 68.65,88.15 68.65,75.15 73.8,70 73.85,70
  Bottom 0.254: JP4.23 63.59,108.83 JP8.23
N$41
  Top 0.254: U1.98 76.35,64.67 76.35,66.75 72.25,70.85 72.2,70.85 67.6,75.45 67.6,85.9 61.05,92.45 JP4.24
  Bottom 0.254: JP8.24 60.9,102.6 JP4.24
N$42
  Top 0.254: U1.99 75.9,64.69 75.9,66.5 73.12,69.28 | 73.12,69.28 71.8,70.6 | JP4.25 58.35,102.3 58.35,93.85 66.85,85.35 66.85,75.6 73.12,69.33 73.12,69.28
  Bottom 0.254: JP4.25 58.51,108.83 JP8.25
N$43
  Top 0.254: U1.100 75.4,64.69 75.4,66.3 71.4,70.3 | 71.4,70.3 71.4,70.35 | JP4.26 55.8,102.29 55.8,93.55 65.95,83.4 65.95,75.75 71.4,70.3
  Bottom 0.254: JP8.26 55.82,102.6 JP4.26
N$44
  Top 0.254: U1.101 74.85,64.67 74.85,66.1 68.88,72.08 67.4,73.55 65.05,75.9 65.05,81.15 53.4,92.8 53.4,102.43 JP4.27
  Bottom 0.254: JP8.27 53.28,102.6 JP4.27
N$45
  Top 0.254: U1.102 74.36,65.84 64,76.2 64,79.3 50.89,92.41 JP4.28
  Bottom 0.254: JP4.28 50.89,108.83 JP8.28
N$46  (2 unrouted)
N$47
  Top 0.254: U1.106 72.36,65.74 62,76.1 60.3,76.1 55.4,81 55.4,84.1 45.7,93.8 45.7,102.35 JP4.30
  Bottom 0.254: JP2.2 55.5,82.22 55.5,83.9 45.81,93.59 JP4.30 45.66,102.6 JP8.30
N$48
  Top 0.254: U1.107 71.86,64.86 71.9,64.9 71.9,65.3 66.2,71 54.8,71 42.8,83 21.4,83 18.8,85.6 13.01,85.6 JP5.1
  Bottom 0.254: JP15.1 12.83,85.42 JP5.1
N$49
  Top 0.254: U1.108 71.36,64.94 66.5,69.8 54.1,69.8 43.2,80.7 21,80.7 18.7,83 12.95,83 JP5.2
  Bottom 0.254: JP5.2 1.61,82.98 JP15.2
N$50
  Top 0.254: U1.109 69,62.9 66.7,65.2 57.1,65.2 43.1,79.2 16.3,79.2 15.1,80.4 12.96,80.4 JP5.3
  Bottom 0.254: JP15.3 12.83,80.34 JP5.3
N$51
  Top 0.254: U1.110 68.5,62.4 66.5,64.4 56.4,64.4 43.2,77.6 13.22,77.6 JP5.4
  Bottom 0.254: JP5.4 1.61,77.9 JP15.4
N$52
  Top 0.254: U1.116 39.3,59.4 38.6,60.1 35.8,60.1 33.9,62 33.9,63.6 33.4,64.1 16,64.1 14.4,62.5 13.08,62.5 JP5.10
  Bottom 0.254: JP15.10 12.83,62.56 JP5.10
N$53
  Top 0.254: U1.117 38.4,58.9 37.8,59.5 35.2,59.5 33,61.7 33,62.7 32.6,63.1 17.3,63.1 14.3,60.1 12.94,60.1 JP5.11
  Bottom 0.254: JP5.11 1.61,60.12 JP15.11
N$54
  Top 0.254: JP5.15 25.69,49.96 27.95,47.7 37.2,47.7 40.65,51.15 50.9,51.15 53.4,53.65 53.4,55.35 53.95,55.9 U1.123
  Bottom 0.254: JP5.15 1.61,49.96 JP15.15
N$55
  Top 0.254: U1.124 54.3,55.4 54,55.1 54,53.55 51.1,50.65 41.05,50.65 37.6,47.2 13.14,47.2 JP5.16
  Bottom 0.254: JP15.16 12.83,47.32 JP5.16
N$56
  Top 0.254: U1.125 54.8,54.9 54.55,54.65 54.55,53.35 51.35,50.15 41.35,50.15 37.85,46.65 17.85,46.65 16,44.8 13,44.8 JP5.17
  Bottom 0.254: JP15.17 12.83,44.78 JP5.17
N$57
  Top 0.254: U1.126 55.35,54.4 55.05,54.1 55.05,53.1 51.5,49.55 41.6,49.55 38.2,46.15 19.2,46.15 15.35,42.3 12.96,42.3 JP5.18
  Bottom 0.254: JP5.18 1.61,42.34 JP15.18
N$58
  Top 0.254: U1.127 56,53.9 55.6,53.5 55.6,52.85 51.75,49 41.85,49 38.35,45.5 20.35,45.5 14.5,39.65 13.07,39.65 JP5.19
  Bottom 0.254: JP15.19 12.83,39.7 JP5.19
N$59
  Top 0.254: U1.128 56.45,53.4 56.25,53.2 56.25,52.6 52,48.35 42,48.35 38.6,44.95 22.4,44.95 14.65,37.2 12.98,37.2 JP5.20
  Bottom 0.254: JP5.20 1.61,37.26 JP15.20
N$60
  Top 0.254: U1.129 57.55,52.9 52.25,47.6 42.3,47.6 38.95,44.25 24.25,44.25 14.75,34.75 12.96,34.75 JP5.21
  Bottom 0.254: JP15.21 12.83,34.62 JP5.21
N$61
  Top 0.254: U1.130 58.05,52.4 52.5,46.85 42.5,46.85 39.2,43.55 26.1,43.55 14.75,32.2 12.95,32.2 JP5.22
  Bottom 0.254: JP5.22 1.61,32.18 JP15.22
N$62
  Top 0.254: U1.131 58.55,51.9 52.85,46.2 42.9,46.2 39.65,42.95 27.75,42.95 14.45,29.65 12.94,29.65 JP5.23
  Bottom 0.254: JP15.23 12.83,29.54 JP5.23
N$63
  Top 0.254: U1.132 59.15,51.4 53.25,45.5 43.2,45.5 40.1,42.4 30.35,42.4 14.95,27 13.02,27 JP5.24
  Bottom 0.254: JP5.24 1.61,27.1 JP15.24
N$64
  Top 0.254: U1.133 59.7,50.9 53.7,44.9 43.6,44.9 40.5,41.8 31.85,41.8 14.55,24.5 12.41,24.5 12.35,24.56 JP5.25
  Bottom 0.254: JP5.25 1.61,24.56 JP15.25
N$65
  Top 0.254: U1.134 67.25,50.4 63.7,46.85 57.45,46.85 54.7,44.1 50.7,44.1 45.15,38.55 43.15,38.55 35.5,30.9 30.2,30.9 21.3,22 12.94,22 JP5.26
  Bottom 0.254: JP15.26 12.83,21.92 JP5.26
N$66
  Top 0.254: U1.135 67.5,49.9 63.9,46.3 57.65,46.3 54.9,43.55 50.95,43.55 45.4,38 43.65,38 35.75,30.1 30.45,30.1 19.75,19.4 13,19.4 JP5.27
  Bottom 0.254: JP5.27 1.61,19.48 JP15.27
N$67
  Top 0.254: U1.136 67.8,49.4 64.15,45.75 57.85,45.75 55.1,43 51.55,43 45.7,37.15 43.8,37.15 35.9,29.25 31.45,29.25 19.05,16.85 13.01,16.85 JP5.28
  Bottom 0.254: JP15.28 12.83,16.84 JP5.28
N$68
  Top 0.254: JP5.29 18.8,14.4 27.3,22.9 27.3,24.1 31.65,28.45 36.3,28.45 44.2,36.35 46,36.35 51.9,42.25 55.35,42.25 58.15,45.05 64.35,45.05 68.2,48.9 U1.137
  Bottom 0.254: JP5.29 1.61,14.4 JP15.29
N$69
  Top 0.254: JP5.30 17.26,11.86 28.05,22.65 28.05,23.9 31.8,27.65 36.75,27.65 44.7,35.6 46.3,35.6 52.05,41.35 55.55,41.35 58.15,43.95 64.1,43.95 68.55,48.4 U1.138
  Bottom 0.254: JP15.30 12.83,11.76 JP5.30
N$70
  Top 0.254: U1.71 91.02,62.4 92.33,63.71 92.33,63.73 92.6,64 92.6,65.8 96.55,69.75 96.55,71.85 99.1,74.4 102.3,74.4 102.65,74.75 102.65,75.65 119.55,92.55 120.24,92.55 JP9.1 | JP10.1 128.63,94.43
  Bottom 0.254: JP9.1 129.13,94.43 129.2,94.5 128.83,94.5 JP10.1
N$71
  Top 0.254: U1.21 81.36,37.36 62.45,18.45 62.45,5.08 JP6.1
  Bottom 0.254: JP6.1 62.43,-2.64 JP7.1
N$72
  Top 0.254: U1.22 81.86,36.81 64.95,19.9 64.95,5.09 JP6.2
  Bottom 0.254: JP6.2 64.97,5.27 65.1,5.4 65.1,-2.51 JP7.2
N$73
  Top 0.254: U1.23 82.36,36.36 67.65,21.65 67.65,5.21 JP6.3
  Bottom 0.254: JP6.3 67.51,-2.64 JP7.3
N$74
  Top 0.254: U1.24 82.86,35.96 70.1,23.2 70.1,5.12 JP6.4
  Bottom 0.254: JP6.4 70.05,-2.64 JP7.4
N$75  (1 unrouted)
  Top 0.254: U1.25 83.36,35.31 72.45,24.4 72.45,5.21 JP6.5
  Bottom 0.254: JP6.5 72.59,-2.09 72.7,-2.2
N$76
  Top 0.254: U1.26 83.86,34.81 78.5,29.45 78.45,29.45 75.05,26.05 75.05,5.15 JP6.6
  Bottom 0.254: JP7.6 75.12,5.05 JP6.6
N$77
  Top 0.254: U1.29 85.36,33.26 82.75,30.65 JP6.9
  Bottom 0.254: JP6.9 82.75,4.45 82.7,4.4 82.7,-2.62 JP7.9
N$78
  Top 0.254: U1.28 84.86,33.71 80.25,29.1 80.25,5.11 JP6.8
  Bottom 0.254: JP6.8 80.21,-2.64 JP7.8
N$79
  Top 0.254: U1.27 84.36,34.21 77.7,27.55 77.7,5.09 JP6.7
  Bottom 0.254: JP6.7 77.67,-2.64 JP7.7
N$80
  Top 0.254: U1.30 85.86,32.51 85.3,31.95 JP6.10
  Bottom 0.254: JP6.10 85.29,-2.64 JP7.10
N$81
  Top 0.254: U1.31 86.36,9.59 87.85,8.1 87.85,5.08 JP6.11
  Bottom 0.254: JP6.11 87.83,-2.64 JP7.11
N$82
  Top 0.254: U1.32 86.86,12.44 90.4,8.9 90.4,5.09 JP6.12
  Bottom 0.254: JP6.12 90.37,3.53 90.4,3.5 90.4,-2.61 JP7.12
N$83
  Top 0.254: U1.33 87.36,15.14 92.9,9.6 92.9,5.08 JP6.13
  Bottom 0.254: JP6.13 92.91,-2.64 JP7.13
N$84
  Top 0.254: U1.34 87.86,17.94 95.4,10.4 95.4,5.12 JP6.14
  Bottom 0.254: JP6.14 95.45,-2.64 JP7.14
N$85
  Top 0.254: U1.35 88.36,20.29 98,10.65 JP6.15
  Bottom 0.254: JP6.15 97.99,-2.64 JP7.15
N$86
  Top 0.254: U1.36 88.86,21.59 100.5,9.95 100.5,5.1 JP6.16
  Bottom 0.254: JP6.16 100.53,-2.64 JP7.16
N$87
  Top 0.254: U1.39 91.4,46.4 91.7,46.1 91.7,44.4 94.1,42 94.1,38.5 99.5,33.1 99.5,18.8 108.1,10.2 108.1,5.12 JP6.19
  Bottom 0.254: JP6.19 108.15,5.05 108.2,5 108.2,-2.59 JP7.19
N$88
  Top 0.254: U1.40 91.6,46.9 92.2,46.3 92.2,44.6 94.6,42.2 94.6,38.7 100,33.3 100,33.2 100,32.7 100,20.9 110.5,10.4 110.5,5.26 JP6.20
  Bottom 0.254: JP6.20 110.69,3.89 110.6,3.8 110.6,-2.58 JP7.20
N$89
  Top 0.254: U1.41 92,47.4 92.8,46.6 92.8,44.7 95.1,42.4 95.1,38.9 100.6,33.4 100.6,22.6 112.9,10.3 112.9,5.4 JP6.21
  Bottom 0.254: JP7.21 113.22,5.05 JP6.21
N$90
  Top 0.254: U1.42 92.2,47.9 93.3,46.8 93.3,44.9 95.6,42.6 95.6,39.2 101.2,33.6 101.2,24.9 115.7,10.4 115.7,5.14 JP6.22
  Bottom 0.254: JP6.22 115.9,4.94 115.9,-1.8 115.76,-1.94 JP7.22
N$91
  Top 0.254: U1.43 92.5,48.4 93.8,47.1 93.8,45.1 96.2,42.7 96.2,39.5 101.9,33.8 101.9,26.8 118.3,10.4 118.3,5.08 JP6.23
  Bottom 0.254: JP6.23 118.31,-2.64 JP7.23
N$92
  Top 0.254: U1.44 90.51,48.8 90.4,48.8 90.5,48.9 92.8,48.9 94.3,47.4 94.3,45.2 96.7,42.8 96.7,39.9 102.5,34.1 102.5,28.7 120.7,10.5 120.7,5.22 JP6.24
  Bottom 0.254: JP6.24 120.85,-2.64 JP7.24
N$93
  Top 0.254: U1.45 93.1,49.4 94.9,47.6 94.9,45.4 97.3,43 97.3,40.1 103.1,34.3 103.1,30.4 123.2,10.3 123.2,5.26 JP6.25
  Bottom 0.254: JP7.25 123.38,5.05 JP6.25
N$94
  Top 0.254: U1.46 93.3,49.9 95.5,47.7 95.5,45.6 97.9,43.2 97.9,40.3 103.7,34.5 103.7,33.3 103.7,32.9 103.7,32.5 126,10.2 126,5.13 JP6.26
  Bottom 0.254: JP6.26 125.93,-2.64 JP7.26
N$95
  Top 0.254: U1.47 93.7,50.4 96.1,48 96.1,45.9 98.5,43.5 98.5,40.5 104.4,34.6 104.4,34.2 128.4,10.2 128.4,5.9 128.8,5.5 128.8,5.39 JP6.27
  Bottom 0.254: JP7.27 128.46,5.05 JP6.27
N$96
  Top 0.254: U1.48 94.2,50.9 96.7,48.4 96.7,46.2 99.1,43.8 99.1,41 104,36.1 105.2,36.1 118.6,22.7 118.6,22.6 131,10.2 131,8.11 131.01,8.1 | JP6.28 131.01,8.1 | 131.01,8.1 131.01,8.69
  Bottom 0.254: JP6.28 131.01,-2.64 JP7.28
N$97
  Top 0.254: 69.8,60.4 62.7,60.4 62,61.1 60.6,61.1 60.5,61.2
N$98
  Bottom 0.254: 60.6,61.1 60.3,61.1 49.2,72.2 49.2,79 50.4,80.2 50.4,82.3
N$99  (via drill 0.6)
  other vias: 71.2,41
N$100
  Top 0.254: 122.18,96.9 JP9.2 120.06,96.97 118.55,95.46 118.55,93.3 101.35,76.1 99.9,76.1 95.8,72 95.8,70 91.8,66 91.8,63.9 90.86,62.95 90.86,62.9 U1.72
  Bottom 0.254: JP10.2 122.18,96.9 JP9.2
N$101
  Top 0.254: JP11.2 34.54,23.44 45.3,34.2 46.6,34.2 52.6,40.2 56.1,40.2 58.5,42.6 60.3,42.6 60.4,42.7 64.4,42.7 68.6,46.9 U1.141
  Bottom 0.254: JP11.2 33.24,18.57 JP12.2
N$106
  Top 0.254: U1.20 80.86,37.81 58.4,15.35 58.3,15.35 57.8,14.85 57.8,5.37 JP19.14
  Bottom 0.254: JP19.14 57.67,-2.31 JP18.1
N$107
  Top 0.254: U1.19 80.36,38.31 58.4,16.35 55.7,16.35 55.1,15.75 55.1,5.26 JP19.13
  Bottom 0.254: JP19.13 55.13,-2.31 JP18.2
N$108
  Top 0.254: U1.18 79.86,38.86 74.15,33.15 74.15,33.1 58,16.95 53.25,16.95 52.45,16.15 52.45,5.37 JP19.12
  Bottom 0.254: JP19.12 52.59,-2.79 52.7,-2.9 52.7,-2.58 JP18.3
N$109
  Top 0.254: U1.17 79.36,39.36 78.75,38.75 78.75,38.7 74.55,34.5 74.55,34.4 57.8,17.65 50.6,17.65 50.2,17.25 50.2,5.39 JP19.11
  Bottom 0.254: JP19.11 50.05,-2.31 JP18.4
N$110
  Top 0.254: U1.16 78.86,39.71 74.7,35.55 74.7,35.4 57.8,18.5 49.7,18.5 47.55,16.35 47.55,5.28 JP19.10
  Bottom 0.254: JP19.10 47.51,-2.31 JP18.5
N$111
  Top 0.254: U1.15 78.36,40.11 73.5,35.25 73.5,35.15 57.8,19.45 47.15,19.45 45.05,17.35 45.05,4.78 44.97,4.7 JP19.9
  Bottom 0.254: JP19.9 44.97,-2.31 JP18.6
N$112
  Top 0.254: U1.14 77.86,40.36 59.6,22.1 59.6,22.05 57.7,20.15 46.35,20.15 42.5,16.3 42.5,5.31 JP19.8
  Bottom 0.254: JP19.8 42.43,-2.31 JP18.7
N$113
  Top 0.254: U1.13 77.36,40.71 57.4,20.75 45.65,20.75 39.8,14.9 39.8,5.32 JP19.7
  Bottom 0.254: JP19.7 39.89,-2.31 JP18.8
N$114
  Top 0.254: U1.12 76.86,41.06 70.25,34.45 70.25,34.4 57.25,21.4 44.65,21.4 37.3,14.05 37.3,5.28 JP19.6
  Bottom 0.254: JP19.6 37.35,-3.05 37.3,-3.1 37.3,-2.42 JP18.9
N$115
  Top 0.254: U1.11 76.36,41.36 61.7,26.7 61.7,26.65 57.2,22.15 44.4,22.15 34.81,12.56 JP19.5
  Bottom 0.254: JP19.5 34.81,-2.31 JP18.10
N$116
  Top 0.254: U1.10 75.86,41.76 57.2,23.1 44.15,23.1 31.65,10.6 31.65,5.85 JP19.4
  Bottom 0.254: JP19.4 32.27,-2.31 JP18.11
N$117
  Top 0.254: U1.9 75.36,42.01 57,23.65 43.75,23.65 31,10.9 30.45,10.9 29.7,10.15 29.7,5.26 JP19.3
  Bottom 0.254: JP19.3 29.73,-2.31 JP18.12
N$118
  Top 0.254: JP19.2 27.19,8.51 27.15,8.55 27.15,9.4 29.6,11.85 31,11.85 43.45,24.3 56.9,24.3 74.9,42.3 74.9,43.62 U1.8
  Bottom 0.254: JP19.2 27.19,-1.89 27.6,-2.3 27.2,-2.3 JP18.13
N$119
  Top 0.254: U1.7 74.4,43.65 74.4,42.5 66.75,34.85 66.7,34.85 56.85,25 43.15,25 31.5,13.35 28.85,13.35 24.4,8.9 24.4,5.48 JP19.1
  Bottom 0.254: JP19.1 24.65,-2.95 24.8,-3.1 24.8,-2.62 JP18.14
N$120
  Top 0.254: U1.68 90.63,60.92 93.91,60.92 96.83,63.84 111.04,63.84 129,81.8 131.4,81.8 JP20.1
  Bottom 0.254: JP21.1 131.51,81.81 JP20.1
N$121
  Top 0.254: U1.67 90.63,60.42 94.21,60.42 96.96,63.17 113.17,63.17 129.1,79.1 131.35,79.1 JP20.2
  Bottom 0.254: JP21.2 131.51,79.27 JP20.2
N$122
  Top 0.254: U1.66 90.63,59.92 94.46,59.92 97.21,62.67 114.97,62.67 128.9,76.6 131.39,76.6 JP20.3
  Bottom 0.254: JP20.3 137.93,76.67 JP21.3
N$123
  Top 0.254: U1.65 90.63,59.42 94.75,59.42 97.46,62.13 116.93,62.13 128.9,74.1 131.43,74.1 JP20.4
  Bottom 0.254: JP21.4 131.51,74.19 JP20.4
N$124
  Top 0.254: U1.64 90.63,58.92 94.96,58.92 97.67,61.63 99.5,61.63 100.04,61.63 118.83,61.63 128.8,71.6 128.8,71.7 131.34,71.7 JP20.5
  Bottom 0.254: JP20.5 137.93,71.59 JP21.5
N$125
  Top 0.254: U1.63 90.63,58.42 95.21,58.42 97.92,61.13 120.63,61.13 128.6,69.1 131.4,69.1 JP20.6
  Bottom 0.254: JP20.6 137.93,69.05 JP21.6
N$126
  Top 0.254: U1.62 90.63,57.92 95.5,57.92 98.21,60.63 100.38,60.63 100.67,60.63 122.63,60.63 128.62,66.62 131.34,66.62 JP20.7
  Bottom 0.254: JP21.7 131.51,66.56 JP20.7
N$127
  Top 0.254: U1.61 90.63,57.42 95.75,57.42 98.46,60.13 110.42,60.13 110.46,60.17 125.17,60.17 128.88,63.88 131.36,63.88 JP20.8
  Bottom 0.254: JP20.8 137.93,63.97 JP21.8
N$128
  Top 0.254: U1.60 90.63,56.92 95.96,56.92 98.62,59.59 125.55,59.59 127.4,61.43 JP20.9
  Bottom 0.254: JP20.9 137.93,61.43 JP21.9
N$129
  Top 0.254: U1.59 90.63,56.42 96.25,56.42 98.88,59.04 127.18,59.04 127.33,58.89 JP20.10
  Bottom 0.254: JP21.10 131.51,58.95 JP20.10
N$130
  Top 0.254: U1.58 90.63,55.92 96.62,55.92 99.12,58.42 107,58.42 109.07,56.35 JP20.11
  Bottom 0.254: JP21.11 131.51,56.41 JP20.11
N$131
  Top 0.254: U1.57 90.66,55.36 96.93,55.36 99.46,57.88 106.52,57.88 110.59,53.81 JP20.12
  Bottom 0.254: JP20.12 131.44,53.82 | 131.44,53.82 130.02,53.82 | 131.44,53.82 137.95,53.82 JP21.12
N$132  (via drill 0.6)
  other vias: 105.62,68.24
N$133
  Top 0.254: U1.38 90.56,45.95 90.52,45.9 88.99,45.9 88.83,45.74 88.83,45.45 92.37,41.91 L1.2 92.37,35.69 C1.1 93.57,34.49 93.57,29.3 | 93.57,29.3 L2.2 | JP6.18 105.61,10.59 93.7,22.5 93.7,29.17 93.57,29.3
  Bottom 0.254: JP6.18 105.61,4.29 105.7,4.2 105.7,-2.55 JP7.18
N$134  (via drill 0.6)
  other vias: 98,71.3
N$135  (via drill 0.6)
  other vias: 105.79,73.05
N$136  (via drill 0.6)
  other vias: 106.7,45.7
N$137  (via drill 0.6)
  other vias: 59.2,40.6
N$138  (via drill 0.6)
  other vias: 62.7,40.7
N$139  (via drill 0.6)
  other vias: 60.3,33.2
N$140  (via drill 0.6)
  other vias: 51.3,36.8
N$141  (via drill 0.6)
  other vias: 97.3,32.13
N$142  (via drill 0.6)
  other vias: 112.7,70.87
N$143  (via drill 0.6)
  other vias: 60.6,61.2
N$145  (via drill 0.6)
  Top 0.254: 69.7,59.9 70.8,59.9 71.6,60.7 71.6,62.3 67.8,66.1 61,66.1 v59.8,67.3
  Bottom 0.254: 52.9,82 52.9,78.5 51.6,77.2 51.6,76.4 51.5,76.3 51.5,73.7 54.1,71.1 56,71.1 v59.8,67.3
VCC  (via drill 0.6)
  Top 0.254: L2.1 97.35,28.73 v97.35,32.08 | U1.53 97,53.4 97.69,52.71 v97.93,52.71 | 71.1,58.4 U1.118 46.3,58.4 46.05,58.15 J2.2 | 74,63 74,61.3 71.1,58.4 | 74,63 74,63.7 73.9,63.8 73.9,64.61 U1.103 | U1.75 87.9,64.61 87.9,63.4 88,63.3 89.25,63.3 90.5,64.55 90.5,65.95 95,70.45 95,73 109,87 v109,88 | 47.9,82.12 JP2.5 | JP3.5 30.3,60.1 v30.4,60.2 | v53,75 53,75.5 47.9,80.6 47.9,82.12 | 71.1,58.4 71.1,58.5 | v65.4,67.8 67.5,67.8 70.8,64.5 70.8,63.8 71.8,62.8 73.8,62.8 74,63 | 47.9,82.12 47.9,85.7 46.8,86.8 46.6,86.8 46.6,86.6 46.7,86.5 | U1.5 73.36,42.86 72.6,42.1 72.4,42.1 v71.2,40.9
  Bottom 0.254: v97.35,32.08 102.53,37.26 L1.1 | J1.2 114.47,40.25 L1.1 | L1.1 102.53,42.36 v100,44.9 99.7,44.9 99.2,45.4 99.2,52.35 98.85,52.71 v97.93,52.71 97.93,55.45 98.23,55.75 109.4,66.72 109.4,77.4 J3.2 119.67,87.93 119.3,88.3 109.3,88.3 v109,88 108.9,88.1 107.9,88.1 106.5,86.7 v46.7,86.7 46.7,83.32 JP2.5 | v65.4,67.8 56.1,75 v53,75 | v30.4,60.2 30.4,61.8 33.8,65.2 37.15,65.2 JP1.2 39.37,65.23 40.2,64.4 40.2,43.1 54.9,28.4 60.6,28.4 71.2,39 v71.2,40.9 | v71.2,40.9 71,40.9 62.7,49.2 50.7,49.2 45.8,54.1 45.8,55.6 J2.2 | v71.2,40.9 90.1,40.9 94.5,45.3 99.6,45.3 100.1,44.8